# EAGLE design AdaFruit MMA8451 (EAGLE 9.2.2)
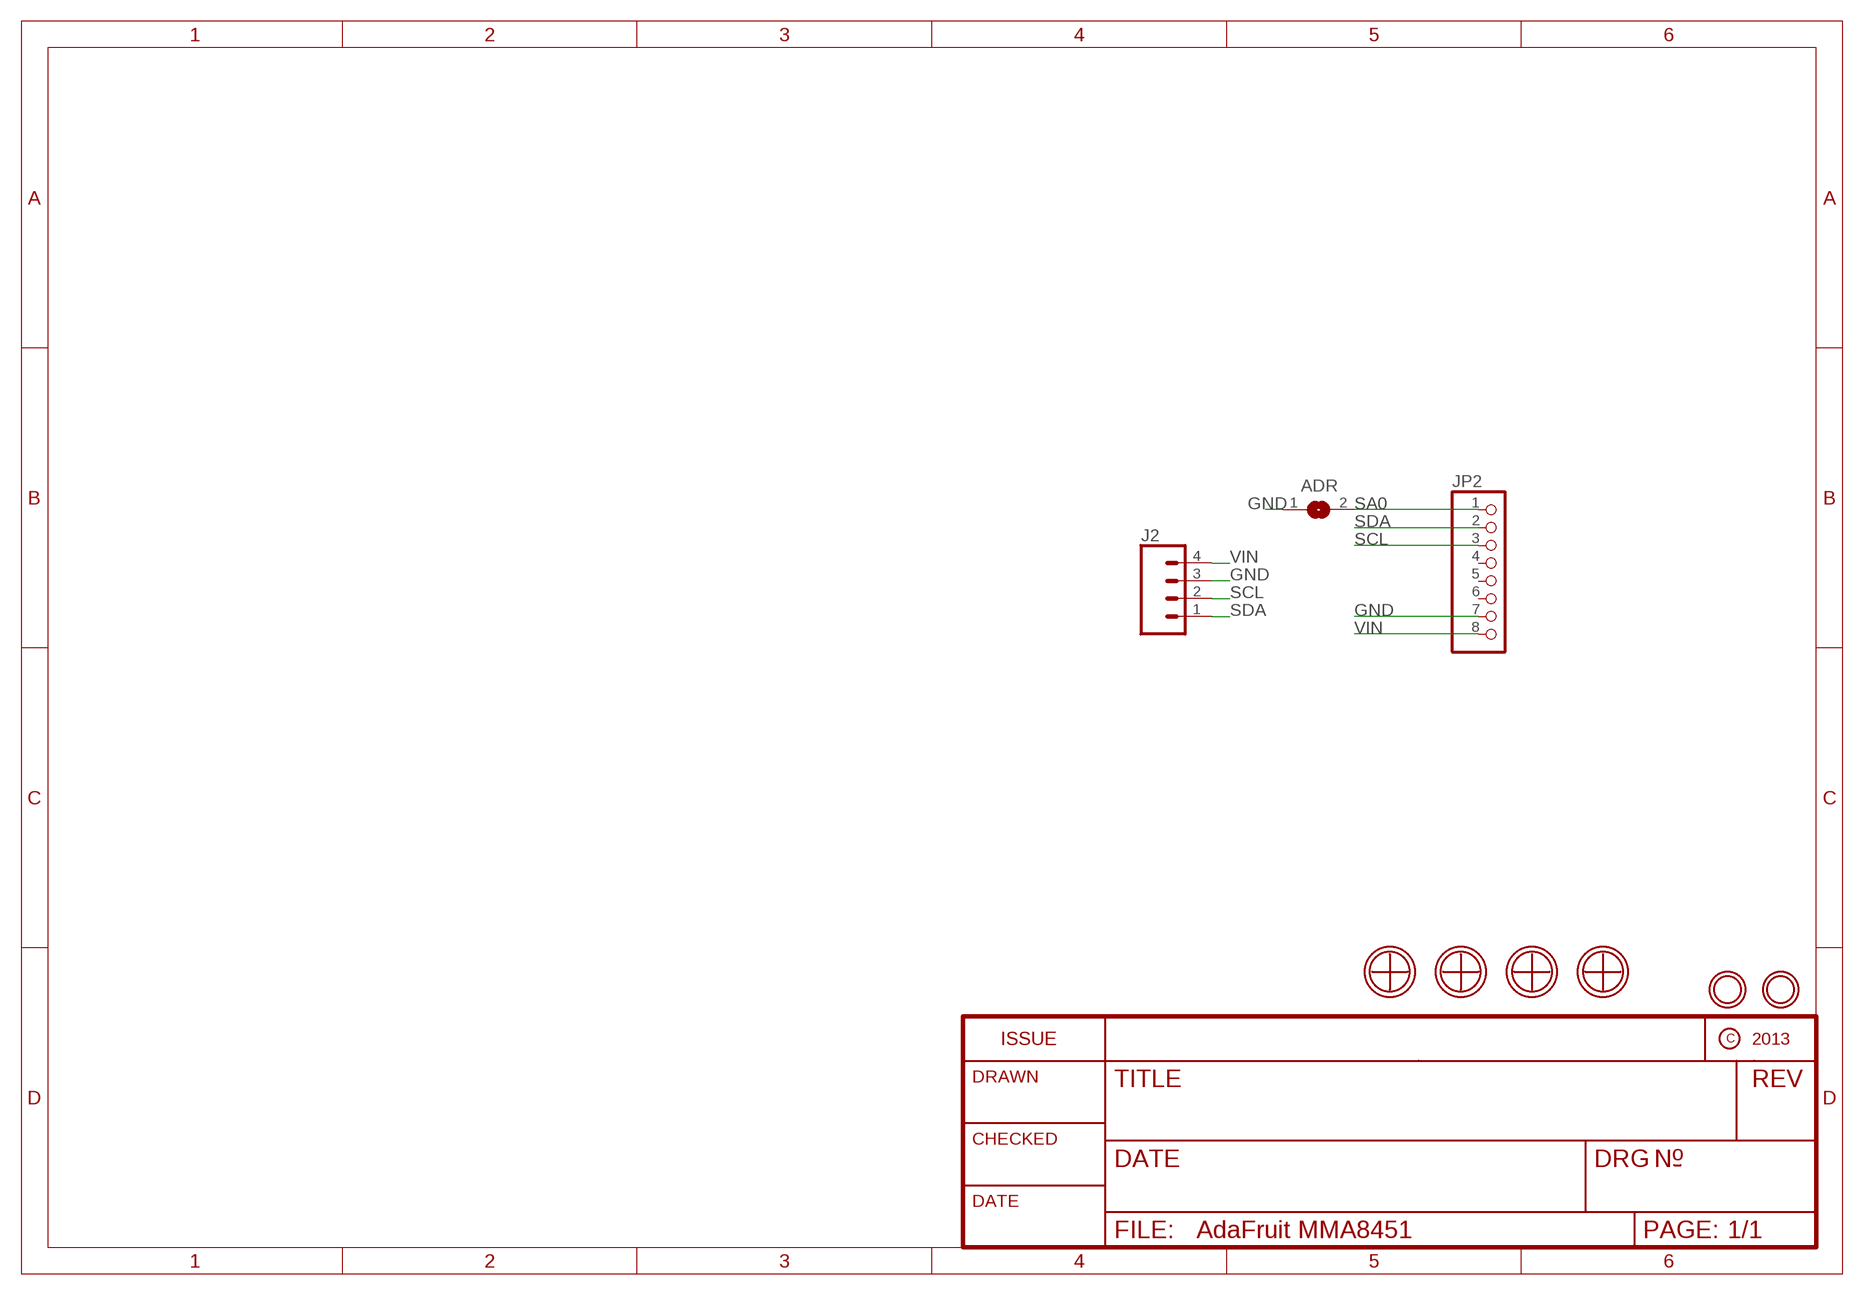
[diagram p0: schematic, sheet 1]

## Parts
ADR  SOLDERJUMPERREFLOW  [SOLDERJUMPER_REFLOW]
J2  CONN_04  [1X04]
JP2  HEADER-1X870MIL  [1X08_ROUND_70]
U$1  MOUNTINGHOLE2.5  [MOUNTINGHOLE_2.5_PLATED]
U$2  MOUNTINGHOLE2.5  [MOUNTINGHOLE_2.5_PLATED]
U$3  3.2MM-5MM  [3.2MM-5MM]
U$4  3.2MM-5MM  [3.2MM-5MM]
U$5  3.2MM-5MM  [3.2MM-5MM]
U$6  3.2MM-5MM  [3.2MM-5MM]

## Nets
GND: ADR.1 J2.3 JP2.7
SA0: ADR.2 JP2.1
SCL: J2.2 JP2.3
SDA: J2.1 JP2.2
VIN: J2.4 JP2.8
Unconnected: JP2.4 JP2.5 JP2.6 U$3.P$1 U$4.P$1 U$5.P$1 U$6.P$1

## Library data of the parts
ADR = #microbuilder:SOLDERJUMPER: SMD Solder JUMPER Solder the two pads together to create a connection, or remove the solder to break it. REFLOW - Use this footprint for solder paste and reflow ovens. WAVE - Use this footprint for hand-soldering (larger pads). CLOSED - Has a trace between the two pads to ensure it is closed by default. The trace needs to be cut to disable the jumper, and can be closed again by creating a solder bridge between the two pads.
J2 = SparkFun-Connectors:CONN_04: Multi connection point. Often used as Generic Header-pin footprint for 0.1 inch spaced/style header connections On any of the 0.1 inch spaced packages, you can populate with these: Break Away Headers - Straight <https://www.sparkfun.com/products/116> (PRT-00116) Break Away Male Headers - Right Angle <https://www.sparkfun.com/products/553> (PRT-00553) Female Headers <https://www.sparkfun.com/products/115> (PRT-00115) Break Away Headers - Machine Pin <https://www.sparkfun.com/products/117> (PRT-00117) Break Away Female Headers - Swiss Machine Pin <https://www.sparkfun.com/products/743> (PRT-00743) For SCREWTERMINALS and SPRING TERMINALS visit here: Screw Terimnals on SparkFun.com <https://www.sparkfun.com/search/results?term=Screw+Terminals> (5mm/3.5mm/2.54mm spacing) This device is also useful as a general connection point to wire up your design to another part of your project. Our various solder wires solder well into these plated through hole pads. Hook-Up Wire - Assortment (Stranded, 22 AWG) <https://www.sparkfun.com/products/11375> (PRT-11375) Hook-Up Wire - Assortment (Solid Core, 22 AWG) <https://www.sparkfun.com/products/11367> (PRT-11367) View the entire wire category on our website here <https://www.sparkfun.com/categories/141> Special notes: Molex polarized connector foot print use with SKU : PRT-08231 with associated crimp pins and housings. 1MM SMD Version SKU: PRT-10208; PROD_ID: CONN-09696
JP2 = microbuilder:HEADER-1X8: PIN HEADER
U$1 U$2 = microbuilder:MOUNTINGHOLE: Mounting Hole For #2 screws (0.086"/2.18mm width, 0.094"/2.4mm hole) use 2.5mm; BOM: EXCLUDE
U$3-U$6 = #Holes:3.2MM-5MM

## Board
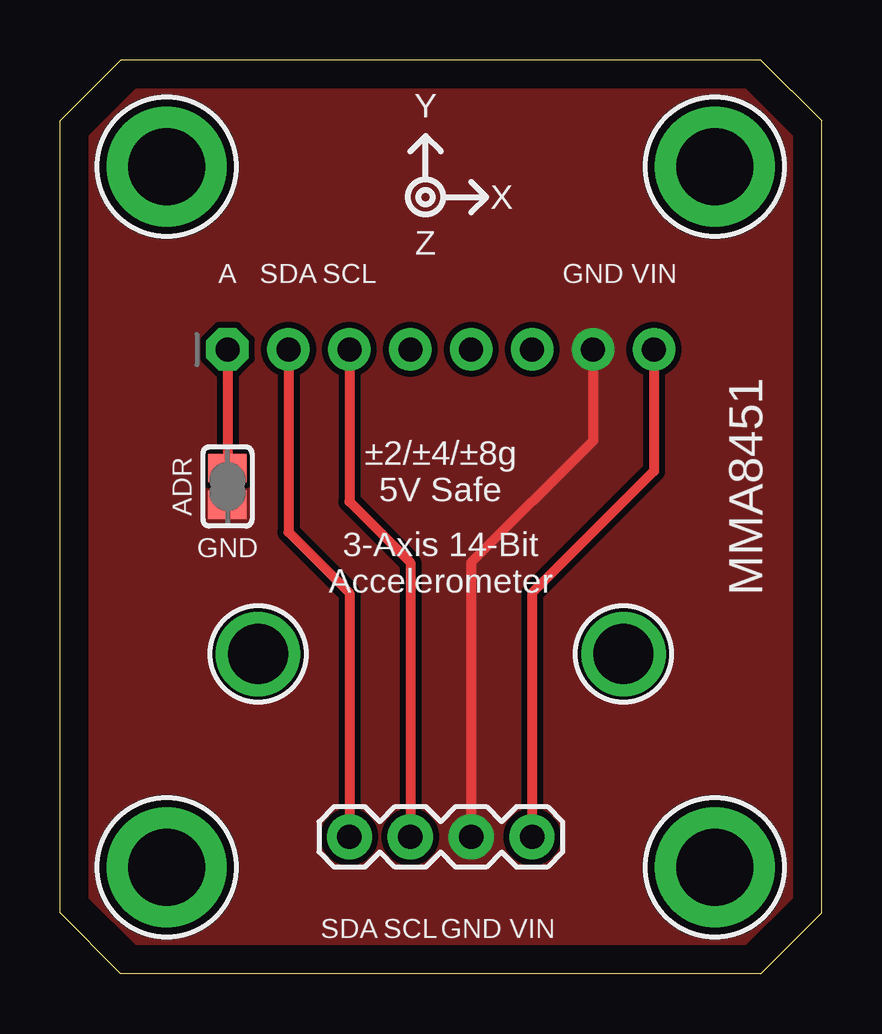
[diagram p1: board, top side]
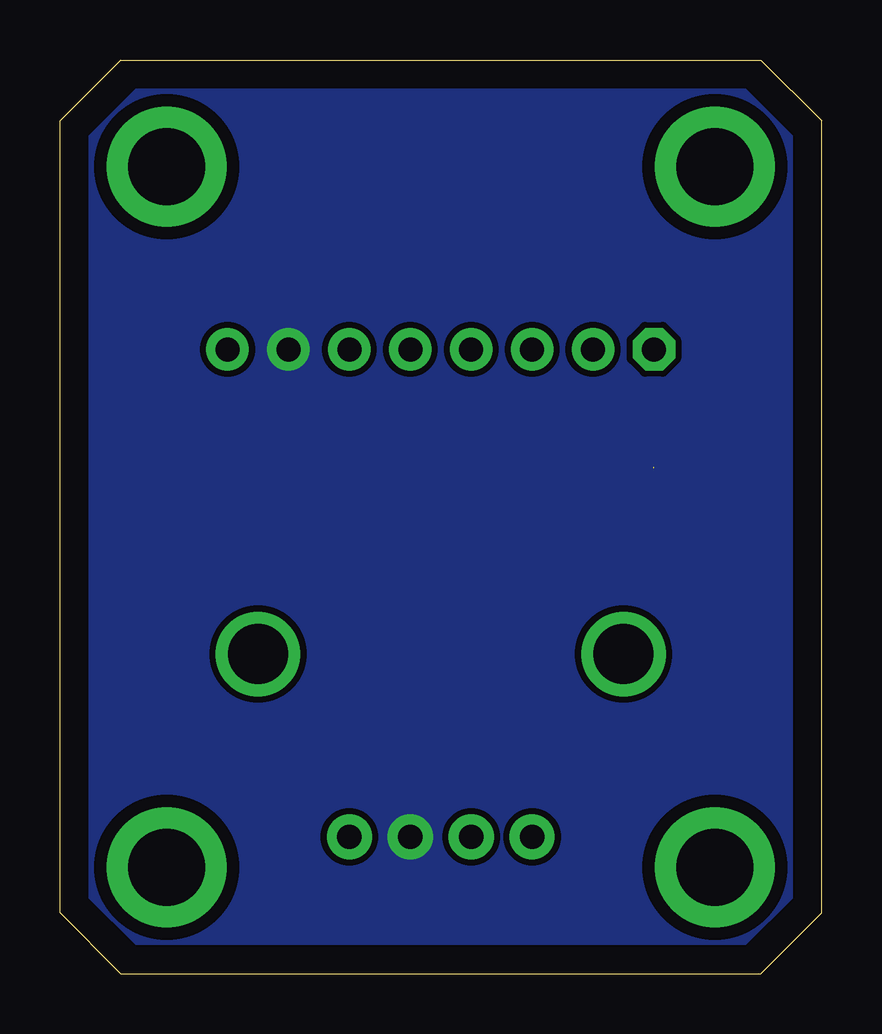
[diagram p2: board, bottom side, seen from below]

Size 31.75 x 38.1 mm. Coordinates in mm from the lower left corner, seen from the top.
Outline: 29.21,0 2.54,0 0,2.54 0,35.56 2.54,38.1 29.21,38.1 31.75,35.56 31.75,2.54 29.21,0
Copper layers (1*16): Top 0.035mm / dielectric 1.5mm / Bottom 0.035mm
Design rules "SparkFun 2 Layer Design Rule - STANDARD": minimum track width 10mil, minimum drill 20mil, track to track 10mil, track to pad 8mil, pad to pad 8mil, via to via 10mil, smd to smd 8mil, copper to edge 8mil, drill to drill 8mil, minimum pad ring 10mil, minimum via ring 10mil, stop-mask expansion 4mil, vias tented up to drill 25mil, thermal gap 10mil

### Footprints (pad centres in the part's own frame; a part is rotated, then mirrored left to right if it is on the bottom)
SOLDERJUMPER_REFLOW = smd 1.168 x 1.6: 1 -0.762,0; 2 0.762,0
1X04 = drill 1.016 pad 1.88: 1 0,0; 2 2.54,0; 3 5.08,0; 4 7.62,0
1X08_ROUND_70 = drill 1 pad 1.778 octagon: 1 -8.89,0 | drill 1 pad 1.778: 2 -6.35,0; 3 -3.81,0; 4 -1.27,0; 5 1.27,0; 6 3.81,0; 7 6.35,0; 8 8.89,0
MOUNTINGHOLE_2.5_PLATED = drill 2.5 pad 3.2: P$1 0,0
3.2MM-5MM = drill 3.2 pad 5: P$1 0,0

### Placement (x,y rotation side)
ADR  6.98,20.32 90 top
J2  12.07,5.71 0 top
JP2  15.88,26.04 0 top
U$1  23.5,13.33 180 top
U$2  8.25,13.33 180 top
U$3  4.45,33.66 0 top
U$4  27.31,33.66 0 top
U$5  4.45,4.44 0 top
U$6  27.31,4.44 0 top

### Tracks (layer width: path | path; a pad name or v marks a point on that pad's centre or on a via)
GND
  Top 0.406: J2.3 17.14,17.14 22.22,22.23 JP2.7
  pour Top (no thermals): 28.57,1.27 3.18,1.27 1.27,3.17 1.27,34.93 3.18,36.83 28.57,36.83 30.48,34.93 30.48,3.17
  pour Bottom (no thermals): 28.57,1.27 3.18,1.27 1.27,3.17 1.27,34.93 3.18,36.83 28.57,36.83 30.48,34.93 30.48,3.17
SA0  (1 unrouted)
  Top 0.406: JP2.1 6.98,21.13
SCL
  Top 0.406: JP2.3 12.07,19.69 14.61,17.14 J2.2
SDA
  Top 0.406: JP2.2 9.52,18.41 12.07,15.87 J2.1
VIN
  Top 0.406: JP2.8 24.76,20.95 19.68,15.87 J2.4

### Text on the board
tPlace: Y | X | Z | A | SDA | SCL | GND | VIN | ±2/±4/±8g / 5V Safe | MMA8451 | GND | 3-Axis 14-Bit / Accelerometer | SDA | SCL | GND | VIN